# EAGLE design snoozerly (EAGLE 6.4)
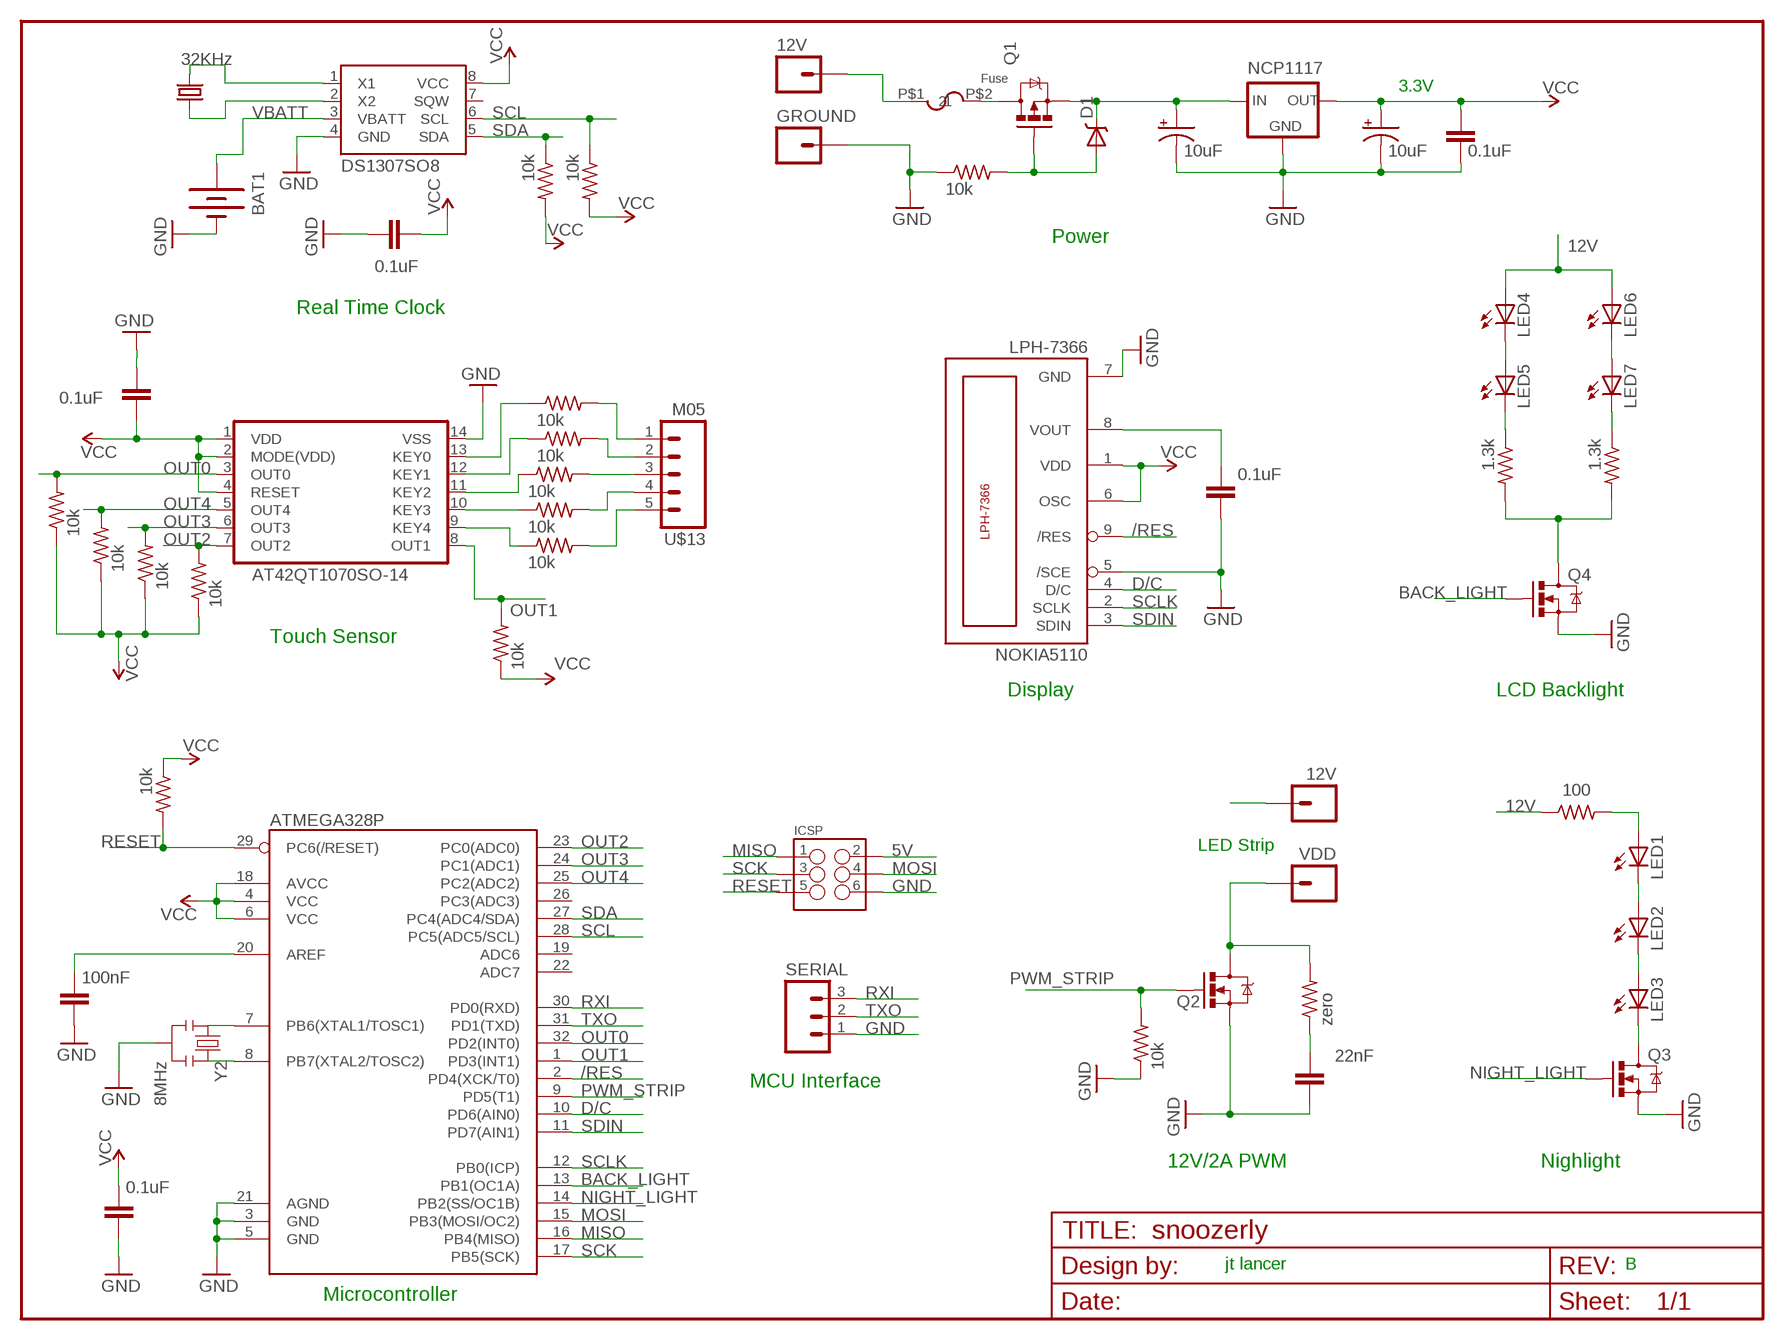
[diagram p0: schematic, sheet 1]

## Parts
12V  M01  [M01_BIGHOLE]
AT42QT1070  AT42QT1070SO-14  [SO-14]
BAT1  BATTERY12MM  [BATTCON_12MM]
C1  100nF  CAP0805  [0805]
C2  0.1uF  CAP0805  [0805]
C3  0.1uF  CAP0805  [0805]
C4  22nF  CAP0805  [0805]
C5  10uF  CAP-POLCAP-PANASONIC-C  [CAP-PANASONIC-C]
C6  0.1uF  CAP0805  [0805]
C7  10uF  CAP-POLCAP-PANASONIC-C  [CAP-PANASONIC-C]
C8  0.1uF  CAP0805  [0805]
C9  0.1uF  CAP0805  [0805]
D1  DIODE-SCHOTTKYDO-214AA  [DO-214AA]
GROUND  M01  [M01_BIGHOLE]
ICSP  M03X2POGO_PINS  [2X3_POGO]
LED1  LED  [SIDEVIEW-LED]
LED2  LED  [SIDEVIEW-LED]
LED3  LED  [SIDEVIEW-LED]
LED4  LED0603  [LED-0603]
LED5  LED0603  [LED-0603]
LED6  LED0603  [LED-0603]
LED7  LED0603  [LED-0603]
NCP1117  VREG-3.3VNCP1117  [TO-252]
NOKIA5110  LPH-7366  [NOKIA5110]
Q1  MOSFET_PCHANNEL  [DPAK]
Q2  MOSFET-NCHANNELFDD8780  [DPAK@1]
Q3  MOSFET-NCHANNELBSS123LT1G  [SOT23]
Q4  MOSFET-NCHANNELBSS123LT1G  [SOT23]
SERIAL  M031X03_NO_SILK  [1X03_NO_SILK]
U1  ATMEGA328P  ATMEGA328_SMT  [TQFP32-08]
U$1  FRAME_LETTER  [CREATIVE_COMMONS]
U$2  10k  RESISTOR  [RESISTOR-0805]
U$3  DS1307SO8  [SO08]
U$4  10k  RESISTOR  [RESISTOR-0805]
U$5  10k  RESISTOR  [RESISTOR-0805]
U$6  10k  R-US_R0603  [R0603]
U$7  10k  R-US_R0603  [R0603]
U$8  10k  R-US_R0603  [R0603]
U$9  10k  R-US_R0603  [R0603]
U$10  10k  R-US_R0603  [R0603]
U$11  10k  R-US_R0603  [R0603]
U$12  Fuse  FUSE  [FUSE-LITTLE-251]
U$13  M05  [M05-SMD]
U$14  10k  RESISTOR  [RESISTOR-0805]
U$15  10k  RESISTOR  [RESISTOR-0805]
U$16  100  RESISTOR  [RESISTOR-0805]
U$17  1.3k  RESISTOR  [RESISTOR-0805]
U$18  1.3k  RESISTOR  [RESISTOR-0805]
U$21  10k  R-US_R0603  [R0603]
U$22  10k  R-US_R0603  [R0603]
U$23  10k  R-US_R0603  [R0603]
U$24  10k  R-US_R0603  [R0603]
U$25  zero  R-US_R0603  [R0603]
U$26  VDD  M01  [M01_BIGHOLE]
U$27  12V  M01  [M01_BIGHOLE]
Y1  32KHz  CRYSTAL32-SMD  [CRYSTAL-32KHZ-SMD]
Y2  8MHz  RESONATOR16MHZ  [RESONATOR-SMD]

## Nets
5V [5V]: AT42QT1070.1(VDD) AT42QT1070.2(MODE(VDD)) AT42QT1070.4(RESET) C2.1 C3.1 C7.+ C8.1 C9.1 ICSP.P$2 NCP1117.2(OUT) NOKIA5110.1(VDD) NOKIA5110.6(OSC) U1.4(VCC) U1.6(VCC) U1.18(AVCC) U$2.1 U$3.8(VCC) U$4.2 U$5.2 U$6.1 U$21.1 U$22.1 U$23.1 U$24.1 ; supply symbol labelled VCC
12V: C5.+ D1.C LED4.A LED6.A NCP1117.3(IN) Q1.3(S) U$16.1 U$27.1
/RES: NOKIA5110.9(/RES) U1.2(PD4(XCK/T0))
BACK_LIGHT: Q4.1(G) U1.13(PB1(OC1A))
D/C: NOKIA5110.4(D/C) U1.10(PD6(AIN0))
GND: AT42QT1070.14(VSS) BAT1.GND(-) C1.2 C2.2 C3.2 C4.1 C5.- C6.1 C7.- C8.2 C9.2 GROUND.1 ICSP.P$6 NCP1117.1(GND) NOKIA5110.5(/SCE) NOKIA5110.7(GND) Q2.3(S) Q3.2(S) Q4.2(S) SERIAL.1 U1.3(GND) U1.5(GND) U1.21(AGND) U$3.4(GND) U$14.1 U$15.1 Y2.2
KEY0: AT42QT1070.13(KEY0) U$7.1
KEY1: AT42QT1070.12(KEY1) U$8.1
KEY2: AT42QT1070.11(KEY2) U$9.1
KEY3: AT42QT1070.10(KEY3) U$10.1
KEY4: AT42QT1070.9(KEY4) U$11.1
MISO: ICSP.P$1 U1.16(PB4(MISO))
MOSI: ICSP.P$4 U1.15(PB3(MOSI/OC2))
N$1: U1.7(PB6(XTAL1/TOSC1)) Y2.1
N$2: LED7.C U$18.1
N$4: U1.8(PB7(XTAL2/TOSC2)) Y2.3
N$5: LED4.C LED5.A
N$6: U$3.1(X1) Y1.X2
N$7: U$3.2(X2) Y1.X1
N$8: 12V.1 U$12.P$1
N$9: LED5.C U$17.1
N$10: Q4.3(D) U$17.2 U$18.2
N$11: C1.1 U1.20(AREF)
N$12: LED1.P$1(A) U$16.2
N$13: Q1.4(D) U$12.P$2
N$14 [12V]: Q2.4(D) U$25.2 U$26.1
N$15: LED1.P$2(C) LED2.P$1(A)
N$16: D1.A Q1.1(G) U$14.2
N$17: LED6.C LED7.A
N$18: C4.2 U$25.1
N$19: U$9.2 U$13.3
N$20: C6.2 NOKIA5110.8(VOUT)
N$21: U$11.2 U$13.5
N$22: LED2.P$2(C) LED3.P$1(A)
N$28: U$10.2 U$13.4
N$30: U$8.2 U$13.2
N$31: U$7.2 U$13.1
N$33: LED3.P$2(C) Q3.3(D)
NIGHT_LIGHT: Q3.1(G) U1.14(PB2(SS/OC1B))
OUT0: AT42QT1070.3(OUT0) U1.32(PD2(INT0)) U$6.2
OUT1: AT42QT1070.8(OUT1) U1.1(PD3(INT1)) U$23.2
OUT2: AT42QT1070.7(OUT2) U1.23(PC0(ADC0)) U$22.2
OUT3: AT42QT1070.6(OUT3) U1.24(PC1(ADC1)) U$21.2
OUT4: AT42QT1070.5(OUT4) U1.25(PC2(ADC2)) U$24.2
PWM_STRIP: Q2.1(G) U1.9(PD5(T1)) U$15.2
RESET: ICSP.P$5 U1.29(PC6(/RESET)) U$2.2
RXI: SERIAL.3 U1.30(PD0(RXD))
SCK: ICSP.P$3 U1.17(PB5(SCK))
SCL: U1.28(PC5(ADC5/SCL)) U$3.6(SCL) U$5.1
SCLK: NOKIA5110.2(SCLK) U1.12(PB0(ICP))
SDA: U1.27(PC4(ADC4/SDA)) U$3.5(SDA) U$4.1
SDIN: NOKIA5110.3(SDIN) U1.11(PD7(AIN1))
TXO: SERIAL.2 U1.31(PD1(TXD))
VBATT: BAT1.PWR@1(+) U$3.3(VBATT)
Unconnected: U1.19(ADC6) U1.22(ADC7) U1.26(PC3(ADC3)) U$3.7(SQW)

## Notes on the sheet
- 3.3V
- Power
- Real Time Clock
- Touch Sensor
- Display | LCD Backlight
- LED Strip
- MCU Interface
- 12V/2A PWM | Nighlight
- jt lancer | B
- Microcontroller

## Library data of the parts
12V GROUND U$26 U$27 = jt_parts:M01
AT42QT1070 = jt_parts:AT42QT1070: Modified from the Sparkfun footprint
BAT1 = SparkFun-Electromechanical:BATTERY: Battery Holders Various common sizes : AA, AAA, 20mm coin cell and 12mm coin cell. 20MM_4LEGS, BATT-10373
C1-C4 C6 C8 C9 = SparkFun-Capacitors:CAP: Capacitor Standard 0603 ceramic capacitor, and 0.1" leaded capacitor.
C5 C7 = jt_parts:CAP-POL: Polarized Caps
D1 = jt_parts:DIODE-SCHOTTKY
ICSP = SparkFun-Connectors:M03X2: 2x3 .1" header. Shrouded, with keying- CONN-10681 SMT- CONN-11415 Pogo pins- HW-11044; PROD_ID: HW-11044
LED1-LED3 = jt_parts:LED
LED4-LED7 = SparkFun-LED:LED: LEDs Standard schematic elements and footprints for 5mm, 3mm, 1206, and 0603 sized LEDs. 5mm - Spark Fun Electronics SKU : COM-00529 (and others)
NCP1117 = jt_parts:VREG-3.3V
NOKIA5110 = jt_parts:LPH-7366
Q1 = jt_parts:MOSFET_PCHANNEL
Q2 = SparkFun-DiscreteSemi:MOSFET-NCHANNEL: Common NMOSFET Parts MFG P/N Store ID Prod ID FDD8780 TRANS-09984 SI7820DN TRANS-11055 FDS6630A IC-08089 2N7002PW TRANS-11151 FQP30N06L COM-10213 TRANS-10060 BSS123LT1G TRANS-08345 BSS138 TRANS-00830 BS170 2N7000; PROD_ID: TRANS-09984
Q3 Q4 = SparkFun-DiscreteSemi:MOSFET-NCHANNEL: Common NMOSFET Parts MFG P/N Store ID Prod ID FDD8780 TRANS-09984 SI7820DN TRANS-11055 FDS6630A IC-08089 2N7002PW TRANS-11151 FQP30N06L COM-10213 TRANS-10060 BSS123LT1G TRANS-08345 BSS138 TRANS-00830 BS170 2N7000; PROD_ID: TRANS-08345
SERIAL = SparkFun-Connectors:M03: Header 3 Standard 3-pin 0.1" header. Use with straight break away headers (SKU : PRT-00116), right angle break away headers (PRT-00553), swiss pins (PRT-00743), machine pins (PRT-00117), and female headers (PRT-00115). Molex polarized connector foot print use with SKU : PRT-08232 with associated crimp pins and housings.
U1 = SparkFun-DigitalIC:ATMEGA328_SMT: 32-Pin Atmega328 part Commonly used on Arduino compatible boards Available in QFP and QFN packages TQFP is IC-09069 QFN is non-stock; PROD_ID: IC-09069
U$1 = jt_parts:FRAME_LETTER: 8.5" x 11" document frame modified from the Sparkfun Aesthetics Library
U$2 U$4 U$5 U$14-U$18 = jt_parts:RESISTOR: Resistor footprints. 0805 modified from Adafruit library.
U$3 = SparkFun-FreqCtrl:DS1307: I2C real-time clock with battery backup.
U$6-U$11 U$21-U$25 = adafruit:R-US_: RESISTOR, American symbol
U$12 = jt_parts:FUSE
U$13 = jt_parts:M05
Y1 = SparkFun-FreqCtrl:CRYSTAL: Various standard crystals. Proven footprints. Spark Fun Electronics SKU : COM-00534
Y2 = SparkFun-FreqCtrl:RESONATOR: Resonator Small SMD resonator. Used, eg, on the Arduino Pro/ Pro Mini boards. 8MHz- XTAL-08895 16MHz- XTAL-08900; PROD_ID: XTAL-08900; VALUE: 16MHz

## Net classes
0 default: width 0.254 mm, clearance 0.203 mm
1 12V: width 2.032 mm, clearance 0.508 mm
2 5V: width 0.305 mm, clearance 0.203 mm

## Board
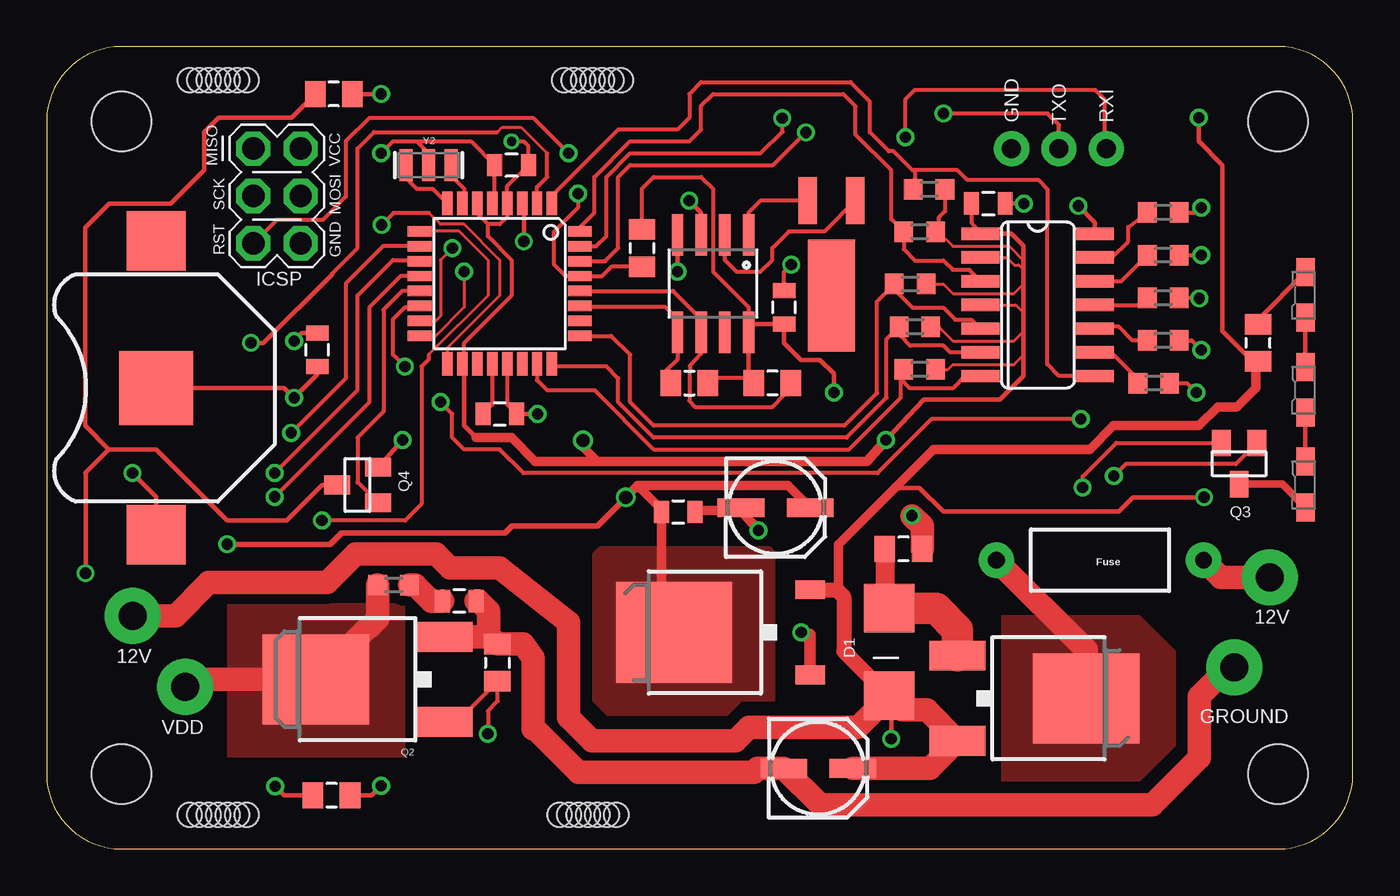
[diagram p1: board, top side]
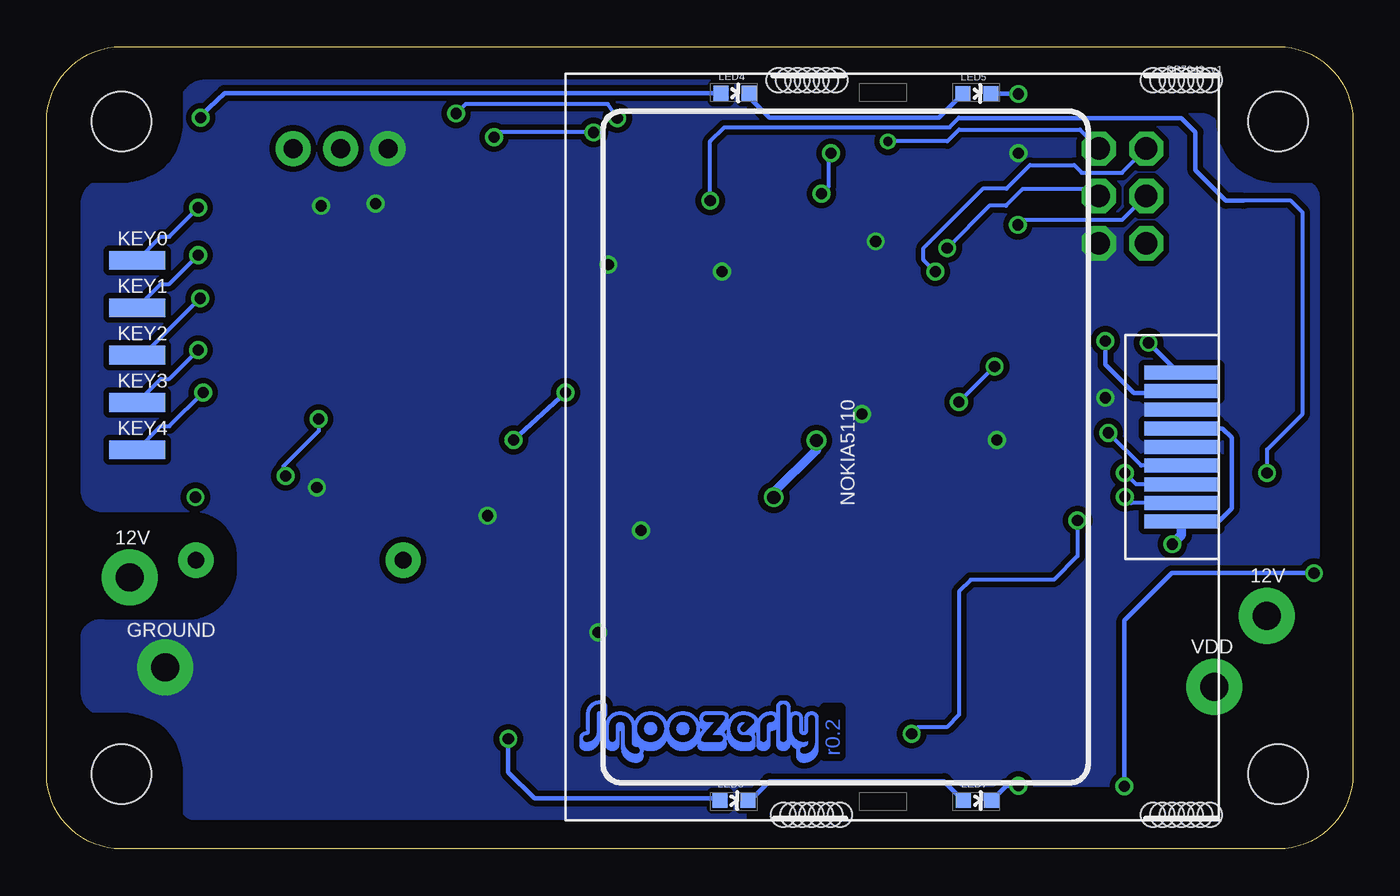
[diagram p2: board, bottom side, seen from below]

Size 70 x 43 mm. Coordinates in mm from the lower left corner, seen from the top.
Copper layers (1*16): Top 0.0356mm / dielectric 1.5011mm / Bottom 0.0356mm
Design rules "LaenPCBOrder": minimum track width 6mil, minimum drill 13mil, track to track 6mil, track to pad 6mil, pad to pad 6mil, via to via 6mil, smd to smd 6mil, copper to edge 15mil, drill to drill 6mil, minimum pad ring 7mil, minimum via ring 7mil, stop-mask expansion 3mil, vias tented up to drill 0mil, thermal gap 10mil
Holes 1.3 mm at 7.67,1.83 8.18,1.83 8.68,1.83 9.19,1.83 9.7,1.83 10.21,1.83 10.72,1.83 27.48,1.83 27.99,1.83 28.5,1.83 29,1.83 29.51,1.83 30.02,1.83 30.53,1.83 7.67,41.2 8.18,41.2 8.68,41.2 9.19,41.2 9.7,41.2 10.21,41.2 10.72,41.2 27.73,41.2 28.24,41.2 28.75,41.2 29.26,41.2 29.77,41.2 30.27,41.2 30.78,41.2

### Footprints (pad centres in the part's own frame; a part is rotated, then mirrored left to right if it is on the bottom)
M01_BIGHOLE = drill 1.5 pad 3: 1 0,0
SO-14 = smd 0.66 x 2.032: 1 -3.81,-3.073; 2 -2.54,-3.073; 3 -1.27,-3.073; 4 0,-3.073; 5 1.27,-3.073; 6 2.54,-3.073; 7 3.81,-3.073; 8 3.81,3.073; 9 2.54,3.073; 10 1.27,3.073; 11 0,3.073; 12 -1.27,3.073; 13 -2.54,3.073; 14 -3.81,3.073
BATTCON_12MM = smd 3.962 x 3.962: GND 0,0 | smd 3.175 x 3.175: PWR@1 -7.874,0; PWR@2 7.874,0
0805 = smd 0.8 x 1.2: 1 -0.9,0; 2 0.9,0
CAP-PANASONIC-C = smd 2.5 x 1: + 1.9,-0.2; - -1.8,-0.2
DO-214AA = smd 2.6 x 2.7: A 2.66,-0.17; C -2.03,-0.17
2X3_POGO = drill 1.2 pad 1.829 octagon: P$1 0,0; P$2 0,2.54; P$3 2.54,0; P$4 2.54,2.54; P$5 5.08,0; P$6 5.08,2.54
SIDEVIEW-LED = smd 1 x 1.5: P$1 0,-1.25; P$2 0,1.2
LED-0603 = smd 0.8 x 0.8: A 0,-0.75; C 0,0.75
TO-252 = smd 1 x 1.6: 1 -2.28,-6.07; 3 2.28,-6.07 | smd 5.4 x 6.2: 2 0,1.23
NOKIA5110 = smd 0.75 x 4: 1 4,17; 2 3,17; 3 2,17; 4 1,17; 5 0,17; 6 -1,17; 7 -2,17; 8 -3,17; 9 -4,17
DPAK = smd 1.6 x 3: 1 -2.28,-2.77; 3 2.28,-2.77 | smd 4.826 x 5.715: 4 0,4.128
DPAK' = smd 1.6 x 3: 1 -2.28,-5.31; 3 2.28,-5.31 | smd 4.826 x 5.715: 4 0,1.588
SOT23 = smd 1 x 1.4: 1 -0.95,-1.1; 2 0.95,-1.1; 3 0,1.1
1X03_NO_SILK = drill 1.016 pad 1.88: 1 0,0; 2 2.54,0; 3 5.08,0
TQFP32-08 = smd 1.27 x 0.559: 1 -4.293,2.8; 2 -4.293,2; 3 -4.293,1.2; 4 -4.293,0.4; 5 -4.293,-0.4; 6 -4.293,-1.2; 7 -4.293,-2; 8 -4.293,-2.8; 17 4.293,-2.8; 18 4.293,-2; 19 4.293,-1.2; 20 4.293,-0.4; 21 4.293,0.4; 22 4.293,1.2; 23 4.293,2; 24 4.293,2.8 | smd 0.559 x 1.27: 9 -2.8,-4.293; 10 -2,-4.293; 11 -1.2,-4.293; 12 -0.4,-4.293; 13 0.4,-4.293; 14 1.2,-4.293; 15 2,-4.293; 16 2.8,-4.293; 25 2.8,4.293; 26 2,4.293; 27 1.2,4.293; 28 0.4,4.293; 29 -0.4,4.293; 30 -1.2,4.293; 31 -2,4.293; 32 -2.8,4.293
RESISTOR-0805 = smd 1.1 x 1.4: 1 -1,0; 2 1,0
SO08 = smd 0.61 x 2.21: 1 -1.905,-2.616; 2 -0.635,-2.616; 3 0.635,-2.616; 4 1.905,-2.616; 5 1.905,2.616; 6 0.635,2.616; 7 -0.635,2.616; 8 -1.905,2.616
R0603 = smd 1 x 1.1: 1 -0.85,0; 2 0.85,0
FUSE-LITTLE-251 = drill 0.9 pad 1.88: P$1 -6.35,-0.03; P$2 4.75,-0.03
M05-SMD = smd 1 x 3: 1 -5.08,-0.08; 2 -2.54,-0.08; 3 0,-0.08; 4 2.54,-0.08; 5 5.08,-0.08
DP7043_V1 = hole 3.2: 4,4; 66,4; 66,39; 4,39
CRYSTAL-32KHZ-SMD = smd 2.5 x 6: SHEILD 0,5.08 | smd 1 x 2.5: X1 -1.27,0; X2 1.27,0
RESONATOR-SMD = smd 0.7 x 1.7: 1 -1.2,0; 2 0,0; 3 1.2,0

### Placement (x,y rotation side)
12V  65.56,14.55 90 top
AT42QT1070  53.11,29.16 270 top
BAT1  5.87,24.71 90 top
C1  24.28,23.31 0 top
C2  24.92,36.65 180 top
C3  39.52,29.03 90 top
C4  22.12,13.28 180 top
C5  41.3,4.52 0 top
C6  14.5,26.74 90 top
C7  39.01,18.49 0 top
C8  33.86,18.06 0 top
C9  50.47,34.59 0 top
D1  44.98,10.23 90 top
GROUND  63.65,9.73 90 top
ICSP  11.07,37.54 270 top
LED1  67.46,29.66 180 top
LED2  67.46,24.58 180 top
LED3  67.46,19.5 180 top
LED4  33.12,40.51 270 bottom
LED5  20.14,40.49 270 bottom
LED6  33.17,2.59 270 bottom
LED7  20.11,2.59 270 bottom
NCP1117  34.85,11.61 90 top
NOKIA5110  26.19,21.54 270 bottom
Q1  51.59,8.07 270 top
Q2  MOSFET-NCHANNELFDD8780  [DPAK']  16.03,9.09 90 top
Q3  63.9,20.65 180 top
Q4  16.66,19.5 90 top
SERIAL  51.71,37.54 0 top
U1  24.28,30.3 270 top
U$1  -15.7,-11.89 0 top  (outside the outline)
U$2  31.9,32.2 270 top
U$3  35.71,30.3 180 top
U$4  34.44,24.97 0 top
U$5  38.89,24.97 180 top
U$6  46.78,33.07 180 top
U$7  59.84,34.11 0 top
U$8  59.84,31.82 0 top
U$9  59.84,29.54 0 top
U$10  59.84,27.25 0 top
U$11  59.33,24.97 0 top
U$12  55.65,15.44 180 top
U$13  65.07,26.46 270 bottom
U$14  45.92,16.08 180 top
U$15  24.15,9.98 270 top
U$16  64.92,27.12 90 top
U$17  15.39,40.46 180 top
U$18  15.26,2.87 180 top
U$19  [SNOOZERLY_TOP]  41.45,4.62 0 bottom
U$20  [DP7043_V1]  70,43 180 top
U$21  46.53,27.99 180 top
U$22  46.78,25.7 180 top
U$23  47.29,35.35 180 top
U$24  46.28,30.27 180 top
U$25  18.59,14.15 180 top
U$26  7.41,8.68 90 top
U$27  4.62,12.49 90 top
Y1  42.06,34.74 180 top
Y2  20.47,36.65 180 top

### Tracks (layer width: path | path; a pad name or v marks a point on that pad's centre or on a via)
5V  (via drill 0.5, 0.6, 0.7)
  Top 0.152: U$22.1 48.31,25.7 48.56,25.96 51.84,25.96 52.35,26.46 | 47.8,27.99 48.56,27.23 51.84,27.23 52.35,27.73 | U$24.1 48.05,30.27 48.56,29.77 51.84,29.77 52.35,30.27 | 47.8,33.07 48.56,32.31 51.59,32.31 52.35,31.54 | AT42QT1070.4 51.94,29.16 52.35,28.75 | AT42QT1070.2 51.46,31.7 51.86,31.29 52.09,31.29 52.35,31.04
  Top 0.203: U1.6 23.01,34.52 23.01,34.11 23.65,33.47 | U1.18 22.38,26.1 22.38,27.12 24.92,29.66 24.92,31.57 23.65,32.84 23.65,33.47 | 23.65,33.47 24.28,33.47 24.68,33.87 U1.4 24.68,35.51 C2.1 25.82,37.65 25.55,37.92 v24.92,37.92 | 37.62,25.24 35.71,25.24 U$4.2 | 37.62,28.39 37.62,29.03 35.71,30.93 35.71,35.38 35.08,36.01 32.54,36.01 31.9,35.38 U$2.1 | 37.62,28.39 U$3.8 | 37.88,28.13 37.62,28.39 | U$21.1 47.8,27.99 | 47.8,33.07 U$6.1 47.8,33.23 47.8,33.83 48.14,34.17 U$23.1 | C9.1 49.57,33.56 AT42QT1070.1
  Top 0.254: U$3.8 37.62,25.24 U$5.2 | 37.88,28.13 C3.1 39.52,27.12 40.43,26.21 41.45,26.21 42.19,25.47 v42.19,24.46 | 23.01,22.04 22.38,22.68 22.38,25.91 U1.18 | 44.65,22.04 v44.98,21.92 47.01,24.08 51.08,24.08 52.35,25.35 52.35,26.46 52.35,27.73 52.35,28.75 52.35,30.27 52.35,31.04 52.35,31.54 52.35,32.33 51.71,32.97 AT42QT1070.1
  Top 0.305: v9.68,16.33 15.19,16.33 15.8,16.94 24.56,16.94 24.94,17.32 29.51,17.32 v31.04,18.84
  Top 0.508: 29.51,20.77 43.97,20.77 v44.98,21.92 | 29.51,20.77 26.19,20.77 24.92,22.04 23.01,22.04 | 31.67,19.48 39.72,19.48 C7.+ | v28.75,21.89 28.75,21.54 29.51,20.77 | 31.67,19.48 v31.04,18.84 | 31.67,19.48 32.96,18.2 C8.1 32.96,11.89 NCP1117.2
  Bottom 0.203: v24.92,37.92 21.74,37.92 21.11,38.55 14.63,38.55 ICSP.P$2
  Bottom 0.254: v42.19,24.46 v44.98,21.92 | NOKIA5110.6 6.99,22.54 6.5,22.04 6.5,18.23 7.14,17.6 9.12,17.6 NOKIA5110.1
  Bottom 0.508: NOKIA5110.1 9.19,16.82 v9.68,16.33 | v31.04,18.84 31.04,19.1 28.75,21.38 v28.75,21.89
  pour Top (no thermals): 29.26,15.8 29.26,7.92 30.02,7.16 36.5,7.16 37.26,7.92 39.04,7.92 39.04,15.92 38.78,16.18 29.64,16.18
12V  (via drill 0.6)
  Top 0.254: v61.75,39.19 61.75,37.92 63.02,36.65 63.02,27.76 64.65,26.12 U$16.1 64.79,26 | v62.02,18.84 58.21,18.84 57.45,18.08 48.05,18.08 46.78,19.35 45.51,19.35 45.49,19.38 | 42.44,13.98 42.35,13.89 | v45.26,5.89 45.26,8.31 | 45.26,8.43 45.26,8.31 | 45.26,8.31 D1.C
  Top 0.508: 64.79,26 64.79,24.7 63.79,23.7 62.76,23.7 61.75,22.68 57.17,22.68 55.9,21.41 47.52,21.41 45.49,19.38 42.44,16.33 42.44,13.98
  Top 0.813: NCP1117.3 42.35,13.89 42.72,13.51 42.72,10.59 45.7,7.61
  Top 1.27: 45.16,7.95 D1.C | D1.C 45.28,8.03 45.7,7.61 45.87,7.44 47.17,7.44 Q1.3 47.34,4.32 C5.+ | D1.C 43.47,6.53 37.64,6.53 36.9,5.79 29.23,5.79 27.96,7.06 27.96,12.14 24.28,15.06 21.61,15.06 20.88,15.8 16.56,15.8 15.03,14.27 8.68,14.27 6.91,12.49 U$27.1
  Bottom 0.254: LED4.A 60.47,40.51 61.74,39.29 v61.75,39.19 | v45.26,5.89 45.26,4.11 43.86,2.72 34.05,2.72 LED6.A
/RES  (via drill 0.6)
  Top 0.152: 26.82,37.28 25.42,38.68 24.41,38.68 24.15,38.43
  Top 0.203: 15.29,30.83 16.66,32.2 16.66,37.54 17.55,38.43 24.15,38.43 | U1.2 26.28,35.47 26.82,36.01 26.82,37.28 | v10.95,27.12 11.12,27.12
  Top 0.254: 15.29,30.83 15.29,30.78 11.61,27.1 10.97,27.1 v10.95,27.12
  Bottom 0.254: NOKIA5110.9 9.36,25.54 v10.95,27.12
BACK_LIGHT
  Top 0.203: U1.13 19.05,29.9 18.06,28.9 18.06,23.44 16.66,22.04 16.66,19.63 16.68,19.63 Q4.1
D/C  (via drill 0.6)
  Top 0.203: U1.10 18.03,32.3 16.03,30.3 16.03,25.22 v13.1,22.3
  Bottom 0.203: NOKIA5110.4 11.34,20.54 v13.1,22.3
GND  (via drill 0.6)
  Top 0.203: U1.21 24.68,23.81 C1.2 | U1.5 24.02,34.73 C2.2 22.75,37.92 19.84,37.92 | v17.93,37.28 18.57,37.92 19.84,37.92 | Y2.2 20.47,37.28 19.84,37.92 | 39.52,30.3 39.52,30.93 v39.9,31.32 | 19.03,21.87 v19.07,21.92 | v55.52,19.38 55.52,19.96 57.33,21.77 62.94,21.77 Q3.2 | v52.37,34.59 C9.2
  Top 0.254: C1.2 v26.31,23.31 | U$3.4 v33.81,30.93 | C3.2 39.52,30.3 | Q4.2 19.03,21.87 | v25.58,32.56 25.58,34.5 U1.3 | AT42QT1070.14 56.18,33.58 v55.29,34.47 | BAT1.GND 12.72,24.71 v13.26,24.18 14.5,25.42 C6.1 | 63.55,9.7 GROUND.1
  Top 0.508: v38.15,17.07 37.21,18.13 | 37.21,18.13 C7.- | 37.21,18.13 34.83,18.13 C8.2
  Top 0.61: 40.54,11.5 40.92,11.5 NCP1117.1
  Top 0.813: 40.54,11.5 v40.43,11.61
  Top 1.016: 23.5,11.54 23.67,11.37
  Top 1.27: Q2.3 23.67,11.37 23.76,11.37 U$15.1 25.53,10.98 26.06,10.23 26.06,6.42 26.19,6.42 28.5,4.11 37.89,4.11 38.1,4.32 C5.- 41.46,2.36 59.26,2.36 61.77,4.87 61.77,8.18 63.29,9.7 63.55,9.7 63.62,9.7 | U$14.1 46.92,17.31 v46.38,17.85 | C4.1 23.14,13.28 23.67,12.75 23.67,11.7 23.5,11.54
  pour Bottom (isolate 0.305, rank 2, no thermals): 1.83,34.86 1.83,15.78 arc90 2.83,14.78 4.87,14.78 arc-90 9.95,9.7 9.95,4.35 arc90 10.95,3.35 31.56,3.35 arc-90 32.56,2.35 32.56,1.57 62.02,1.57 arc90 62.79,2.33 62.79,4.62 arc-90 65.33,7.16 66.85,7.16 arc90 68.12,8.43 68.12,11.48 arc90 66.85,12.24 62.28,12.24 arc-90 59.74,15.29 59.74,15.8 arc-90 62.28,18.08 66.85,18.08 arc90 68.12,19.1 68.12,34.59 arc90 66.85,35.86 65.33,35.86 arc-90 62.79,38.4 62.79,39.93 arc90 61.52,41.2 33.83,41.2 arc90 32.56,39.93 32.56,39.42 8.16,39.42 arc90 7.16,38.42 7.16,38.4 arc-90 4.62,35.86 2.83,35.86 arc90
KEY0
  Top 0.203: AT42QT1070.13 57.1,31.7 57.96,32.56 57.96,33.33 U$7.1
KEY1
  Top 0.203: AT42QT1070.12 57.59,30.43 U$8.1
KEY2
  Top 0.203: 58.7,29.28 U$9.1 58.86,29.16 AT42QT1070.11
KEY3
  Top 0.203: U$10.1 58.19,27.25 57.45,27.99 56.28,27.99 AT42QT1070.10
KEY4
  Top 0.203: U$11.1 58.48,25.18 56.94,26.72 56.28,26.72 AT42QT1070.9
MISO  (via drill 0.6)
  Top 0.152: v22.38,30.93 22.38,29.03 20.85,27.5 U1.16
  Bottom 0.203: v22.38,30.93 23.01,31.57 23.01,32.2 19.84,35.38 18.57,35.38 17.3,36.65 14.93,36.65 14.53,36.24 12.37,36.24 ICSP.P$1
MOSI  (via drill 0.6)
  Top 0.152: U1.15 20.85,28.3 21.11,28.55 21.11,31.57 v21.74,32.2
  Bottom 0.203: v21.74,32.2 19.48,34.47 18.59,34.47 17.68,35.38 13.99,35.38 ICSP.P$4
N$1
  Top 0.203: Y2.1 21.67,36.08 22.38,35.38 22.38,34.69 U1.7
N$2  (via drill 0.6)
  Top 0.254: U$18.1 17.42,2.87 v17.93,3.38
  Bottom 0.254: v17.93,3.38 18.58,3.38 LED7.C
N$4
  Top 0.203: Y2.3 19.27,35.94 19.84,35.38 20.69,35.38 U1.8
N$5
  Bottom 0.254: LED4.C 32.37,40.29 31.27,39.19 22.19,39.19 LED5.A
N$6
  Top 0.203: 37.69,32.84 U$3.1 37.62,34.11 38.25,34.74 Y1.X2
N$7
  Top 0.203: Y1.X1 41.68,33.09 39.77,33.09 38.89,32.2 38.89,31.57 38.25,30.93 36.98,30.93 36.35,31.57 U$3.2
N$8
  Top 1.27: 12V.1 62.92,14.55 U$12.P$1
N$9  (via drill 0.6)
  Top 0.254: v17.93,40.46 U$17.1
  Bottom 0.254: LED5.C 17.96,40.49 v17.93,40.46
N$10  (via drill 0.6)
  Top 0.254: 3.33,21.41 2.06,20.14 2.08,20.11 v2.08,14.78 | 3.33,21.41 2.06,22.68 2.06,33.3 3.35,34.59 6.65,34.59 8.43,36.37 8.43,38.4 9.22,39.19 13.12,39.19 U$17.2 | Q4.3 14.76,19.5 12.85,17.6 9.68,17.6 5.87,21.41 3.33,21.41 | U$18.2 12.72,2.87 v12.24,3.35
  Bottom 0.254: v12.24,3.35 12.24,12.24 9.7,14.78 v2.08,14.78
N$11
  Top 0.203: U1.20 23.88,23.81 C1.1
N$12
  Top 0.203: U$16.2 64.92,28.37
  Top 0.254: 64.92,28.37 LED1.P$1
N$13
  Top 1.27: Q1.4 55.71,10.66 U$12.P$2
  pour Top (no thermals): 60.48,5.53 58.57,3.63 51.18,3.63 51.2,12.52 58.57,12.52 60.48,10.61
N$14
  Top 1.016: 17.67,12.25 17.36,11.95 17.3,11.88
  Top 1.27: 17.3,11.88 17.26,11.88 14.76,9.38 | 14.76,9.38 14.76,9.34 14.69,9.34 Q2.4 7.82,9.09 U$26.1 | U$25.2 17.74,12.33 17.36,11.95 | 14.56,9.19 14.76,9.38
  pour Top (isolate 0.254, no thermals): 19.2,13.15 9.68,13.15 9.68,4.9 19.2,4.9
N$15
  Top 0.254: LED1.P$2 LED2.P$1
N$16
  Top 1.016: U$14.2 44.92,13.12 D1.A
  Top 1.676: Q1.1 48.82,11.73 47.67,12.88 45.17,12.88 D1.A
N$17
  Bottom 0.254: LED6.C 32.31,2.59 31.27,3.63 21.91,3.63 LED7.A
N$18
  Top 1.27: U$25.1 19.73,14.15 20.62,13.26 21.2,13.26 C4.2
N$19  (via drill 0.6)
  Top 0.203: v61.77,29.51 60.72,29.51 U$9.2
  Bottom 0.203: U$13.3 64.82,26.46 v61.77,29.51
N$20  (via drill 0.6)
  Top 0.254: C6.2 13.67,27.64 v13.26,27.23
  Bottom 0.254: v13.26,27.23 13.26,25.96 11.73,24.43 9.29,24.43 NOKIA5110.8
N$21  (via drill 0.6)
  Top 0.203: U$11.2 61.11,24.97 v61.62,24.46
  Bottom 0.203: v61.62,24.46 63.42,22.65 63.88,22.65 U$13.5
N$22
  Top 0.254: LED2.P$2 LED3.P$1
N$28  (via drill 0.6)
  Top 0.203: U$10.2 61.36,27.25 v61.87,26.74
  Bottom 0.203: v61.87,26.74 63.42,25.19 63.88,25.19 U$13.4
N$30  (via drill 0.6)
  Top 0.203: U$8.2 v61.87,31.82
  Bottom 0.203: v61.87,31.82 63.42,30.27 63.88,30.27 U$13.2
N$31  (via drill 0.6)
  Top 0.203: U$7.2 61.62,34.11 v61.87,34.36
  Bottom 0.203: v61.87,34.36 63.42,32.81 63.88,32.81 U$13.1
N$33
  Top 0.254: 67.23,18.53 LED3.P$2
  Top 0.406: Q3.3 66.22,19.55 LED3.P$2
NIGHT_LIGHT  (via drill 0.6)
  Top 0.203: v21.11,23.95 21.74,23.31 21.74,22.04 22.38,21.41 24.28,21.41 25.55,20.14 44.52,20.14 47.42,23.04 v55.42,23.04 | v19.2,25.85 18.57,26.49 18.57,28.39 19.2,29.03 19.92,29.03 U1.14 | Q3.1 63.73,20.62 57.83,20.62 v57.2,19.99
  Bottom 0.203: v21.11,23.95 v19.2,25.85 | v55.42,23.04 55.42,22.4 57.33,20.5 57.33,20.11 v57.2,19.99
OUT0
  Top 0.203: U1.32 28.57,33.32 29.36,34.11 29.36,36.01 31.27,37.92 34.44,37.92 35.08,38.55 35.08,39.82 35.71,40.46 42.7,40.46 43.36,39.8 43.36,38.28 45.26,36.37 45.26,33.74 U$6.2 45.93,32.14 46.53,31.54 48.05,31.54 48.56,31.04 49.45,31.04 49.45,31.01 AT42QT1070.3
OUT1
  Top 0.203: AT42QT1070.8 54.25,25.35 53.62,25.98 53.62,33.6 53.64,33.63 53.64,35.35 53.13,35.86 49.32,35.86 48.82,36.37 46.53,36.37 | U1.1 27.08,35 30.63,38.55 33.81,38.55 34.44,39.19 34.44,40.46 35.08,41.09 43.08,41.09 44.12,40.05 44.12,38.4 45.13,37.39 45.39,37.39 46.4,36.37 46.53,36.37 | 46.53,36.37 46.53,35.95 U$23.2
OUT2
  Top 0.203: U1.23 26.28,25.12 26.82,24.58 29.36,24.58 32.54,21.41 43,21.41 45.77,24.18 45.77,25.19 | 45.77,25.19 45.77,25.54 U$22.2 | AT42QT1070.7 49.22,25.35 48.56,24.69 46.28,24.69 45.77,25.19
OUT3
  Top 0.203: U1.24 27.23,25.85 30,25.85 30.63,25.22 30.63,23.95 32.54,22.04 42.87,22.04 45.01,24.18 45.01,27.31 U$21.2 45.77,27.99 45.77,27.48 46.28,26.97 48.05,26.97 48.41,26.62 AT42QT1070.6
OUT4
  Top 0.203: U1.25 30.26,27.5 31.27,26.49 31.27,23.95 32.54,22.68 42.75,22.68 44.5,24.43 44.5,29.35 U$24.2 45.43,29.98 46.4,29 48.05,29 48.69,28.37 49.55,28.37 AT42QT1070.5
PWM_STRIP  (via drill 0.6)
  Top 0.152: 20.47,26.49 23.65,29.66 23.65,31.57 22.12,33.1 U1.9
  Top 0.203: v14.76,17.6 19.2,17.6 20.09,18.49 20.09,25.85 20.47,26.24 20.47,26.49 | v23.65,6.17 23.65,7.39 24.18,7.92 24.18,8.95 U$15.2 21.98,6.81 Q2.1
  Bottom 0.203: v14.76,17.6 14.76,15.69 16.03,14.42 20.47,14.42 21.11,13.79 21.11,7.19 21.77,6.53 23.29,6.53 v23.65,6.17
RESET  (via drill 0.6)
  Top 0.203: U$2.2 30.27,31.2 29.76,30.7 U1.29 27.82,30.7 27.2,31.32 27.2,33.09 28.47,34.36 v28.47,35.13 | v27.96,37.28 26.06,39.19 17.3,39.19 16.03,37.92 16.03,34.95 14.78,33.7 12.32,33.7 ICSP.P$5
  Bottom 0.203: v27.96,37.28 28.09,37.28 28.09,35.51 v28.47,35.13
RXI  (via drill 0.6)
  Top 0.203: U1.30 29.93,31.5 30.63,32.2 30.63,36.01 31.27,36.65 38.94,36.65 v40.69,38.4 | v46.02,38.15 46.02,40.18 46.53,40.69 56.18,40.69 56.69,40.18 56.69,37.64 SERIAL.3
  Bottom 0.203: v40.69,38.4 45.77,38.4 v46.02,38.15
SCK  (via drill 0.6)
  Top 0.152: U1.17 21.48,26.86 24.28,29.66 24.28,31.57 22.38,33.47 21.11,33.47 20.5,34.08
  Top 0.203: 20.5,34.08 18.59,34.08 v17.96,33.45
  Bottom 0.203: ICSP.P$3 12.37,33.7 17.7,33.7 v17.96,33.45
SCL
  Top 0.203: U$5.1 39.52,24.6 39.52,24.33 38.89,23.7 34.76,23.7 34.44,24.01 34.44,25.6 34.47,25.63 34.47,25.91 34.77,26.22 35.08,26.54 U$3.6 35.08,28.39 33.57,29.9 U1.28
SCLK  (via drill 0.6)
  Top 0.203: v12.22,18.87 17.3,23.95 17.3,29.03 18.97,30.7 U1.12
  Bottom 0.203: NOKIA5110.2 11.88,18.54 v12.22,18.87
SDA
  Top 0.203: U$4.1 33.17,25.24 33.17,25.6 33.81,26.24 U$3.5 33.81,28.39 33.17,29.03 28.64,29.03 U1.27
SDIN  (via drill 0.6)
  Top 0.203: v12.22,20.14 16.66,24.58 16.66,29.66 18.57,31.57 19.92,31.57 U1.11
  Bottom 0.203: NOKIA5110.3 11.61,19.54 v12.22,20.14
TXO  (via drill 0.6)
  Top 0.203: U1.31 29.46,32.3 30,32.84 30,36.01 31.27,37.28 38.25,37.28 39.39,38.43 39.44,38.43 v39.42,39.16 | SERIAL.2 54.25,38.81 53.64,39.42 v48.05,39.42
  Bottom 0.203: v39.42,39.16 39.93,39.93 47.55,39.93 v48.05,39.42
VBATT  (via drill 0.6)
  Top 0.254: BAT1.PWR@1 5.87,18.87 v4.6,20.14 | v34.44,34.74 35.08,34.11 U$3.3
  Bottom 0.203: 21.11,39.19 21.61,38.68 33.68,38.68 34.44,37.92 v34.44,34.74 | v4.6,20.14 4.6,21.41 2.69,23.31 2.69,34.11 3.33,34.74 5.87,34.74
  Bottom 0.254: 5.87,34.74 6.8,34.74 8.43,36.37 8.43,38.4 9.19,39.16 21.08,39.16 21.11,39.19

### Text on the board
tNames: VCC | GND | TXO | RXI | MISO | SCK | MOSI | RST | GND | 12V | VDD
bNames: KEY0 | KEY1 | KEY2 | KEY3 | KEY4 | 12V | 12V | VDD | GROUND